# Altium project MainBoard.PrjPCB
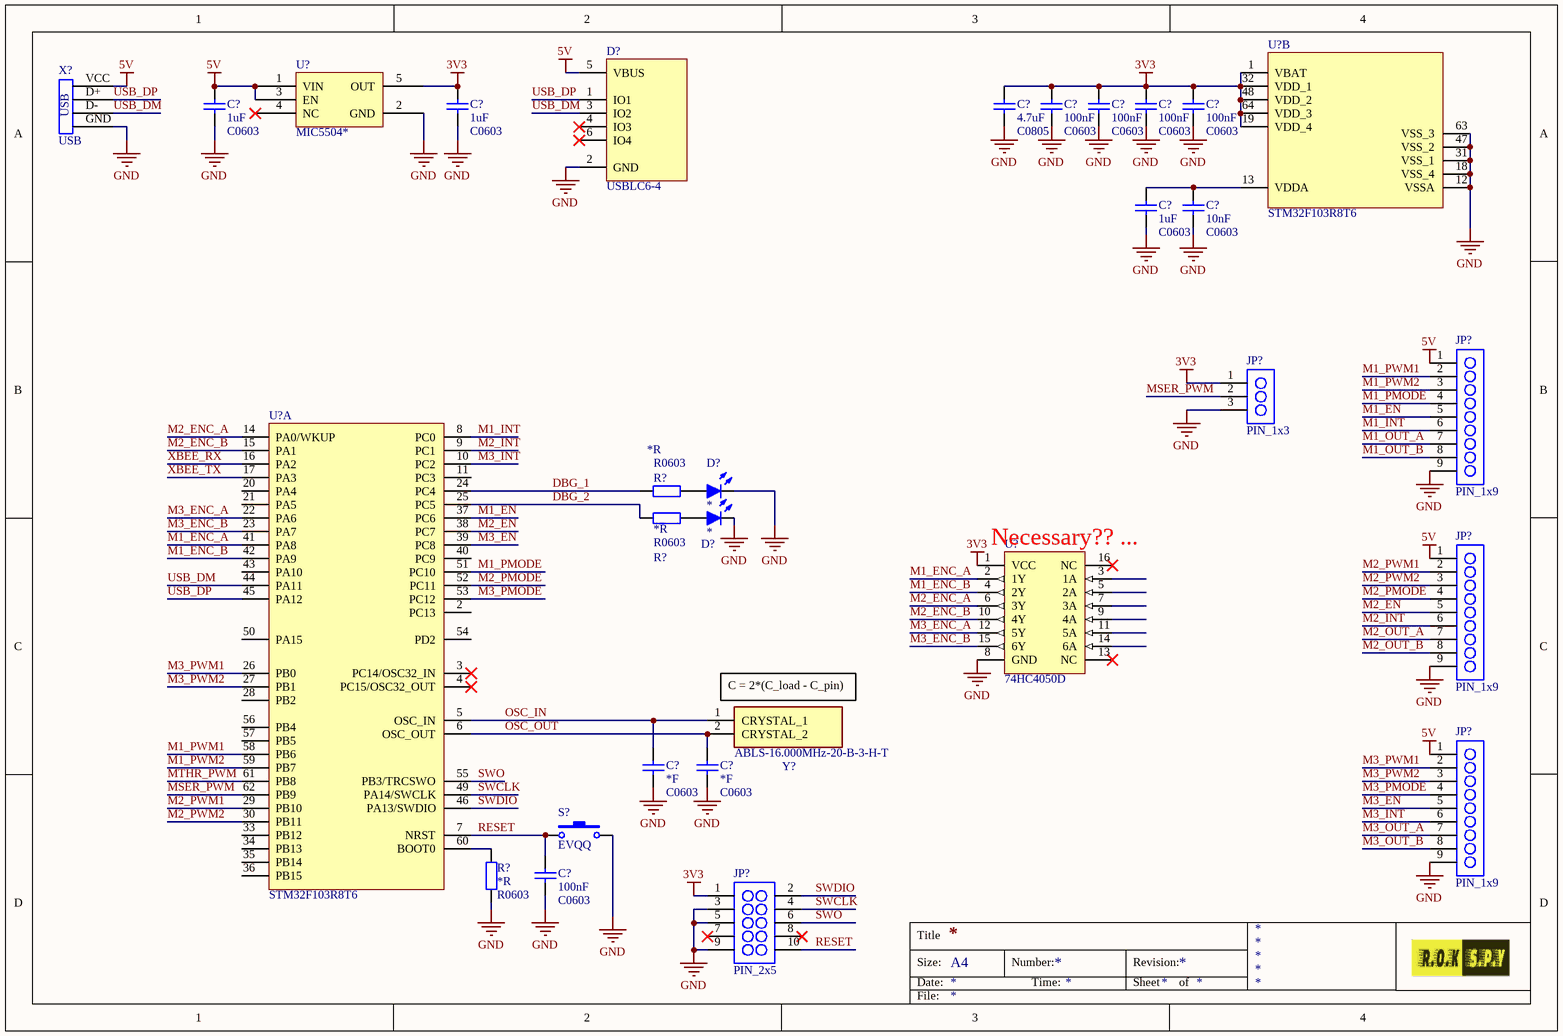
[diagram p0: MainBoard.SchDoc]
1 sheet, 30 parts. Net scope: global (net labels, ports and power ports of the same name join across sheets).
Board file: MainBoard.PcbDoc

## Sheet MainBoard.SchDoc
size A4

### Parts
(Parts that share a designator on the sheet are numbered #1, #2 ... from top to bottom, then left to right.)
C?#1  Capacitance: 1uF  [C0603]
C?#2  Capacitance: 1uF  [C0603]
C?#3  Capacitance: 4.7uF  [C0805]
C?#4  Capacitance: 100nF  [C0603]
C?#5  Capacitance: 100nF  [C0603]
C?#6  Capacitance: 100nF  [C0603]
C?#7  Capacitance: 100nF  [C0603]
C?#8  Capacitance: 1uF  [C0603]
C?#9  Capacitance: 10nF  [C0603]
C?#10  Capacitance: *F  [C0603]
C?#11  Capacitance: *F  [C0603]
C?#12  Capacitance: 100nF  [C0603]
D?#1  USBLC6-4  [SOT-236]
D?#2  LED  [LED_0603]  (value not drawn)
D?#3  LED  [LED_0603]  (value not drawn)
JP?#1  PIN_1x9  [2.54_1X9H]
JP?#2  PIN_1x3  [1.27_1X3R]
JP?#3  PIN_1x9  [2.54_1X9H]
JP?#4  PIN_1x9  [2.54_1X9H]
JP?#5  PIN_2x5  [2.54_2X5H]
R?#1  *R  [R0603]
R?#2  *R  [R0603]
R?#3  *R  [R0603]
S?  EVQQ  [EVQQ]
U?#1  MIC5504*  [SOT-235]
U?#2  STM32F103R8T6  [QFP50P1200X1200X160-64N]  (part B of 2)
U?#3  74HC4050D  [SOP127P600X175-16N]
U?#4  STM32F103R8T6  [QFP50P1200X1200X160-64N]  (part A of 2)
X?  USB  [USB MiniB SMD]
Y?  ABLS-16.000MHz-20-B-3-H-T  [ABLS16000MHz20B3HT]

### Nets
3V3: C?#2.2 C?#3.2 C?#4.2 C?#5.2 C?#6.2 C?#7.2 JP?#2.1 JP?#5.1 U?#1.5(OUT) U?#2.1(VBAT) U?#2.19(VDD_4) U?#2.32(VDD_1) U?#2.48(VDD_2) U?#2.64(VDD_3) U?#3.1(VCC)
5V: C?#1.2 D?#1.5(VBUS) JP?#1.1 JP?#3.1 JP?#4.1 U?#1.1(VIN) U?#1.3(EN) X?.VCC
GND: C?#1.1 C?#2.1 C?#3.1 C?#4.1 C?#5.1 C?#6.1 C?#7.1 C?#8.1 C?#9.1 C?#10.1 C?#11.1 C?#12.1 D?#1.2(GND) D?#2.2(K) D?#3.2(K) JP?#1.9 JP?#2.3 JP?#3.9 JP?#4.9 JP?#5.3 JP?#5.5 JP?#5.9 R?#3.1 S?.2 U?#1.2(GND) U?#2.12(VSSA) U?#2.18(VSS_4) U?#2.31(VSS_1) U?#2.47(VSS_2) U?#2.63(VSS_3) U?#3.8(GND) X?.GND
DBG_1: R?#1.2 U?#4.24(PC4)
DBG_2: R?#2.2 U?#4.25(PC5)
M1_EN: JP?#1.5 U?#4.37(PC6)
M1_ENC_A: U?#3.2(1Y) U?#4.41(PA8)
M1_ENC_B: U?#3.4(2Y) U?#4.42(PA9)
M1_INT: JP?#1.6 U?#4.8(PC0)
M1_OUT_A: JP?#1.7
M1_OUT_B: JP?#1.8
M1_PMODE: JP?#1.4 U?#4.51(PC10)
M1_PWM1: JP?#1.2 U?#4.58(PB6)
M1_PWM2: JP?#1.3 U?#4.59(PB7)
M2_EN: JP?#3.5 U?#4.38(PC7)
M2_ENC_A: U?#3.6(3Y) U?#4.14(PA0/WKUP)
M2_ENC_B: U?#3.10(4Y) U?#4.15(PA1)
M2_INT: JP?#3.6 U?#4.9(PC1)
M2_OUT_A: JP?#3.7
M2_OUT_B: JP?#3.8
M2_PMODE: JP?#3.4 U?#4.52(PC11)
M2_PWM1: JP?#3.2 U?#4.29(PB10)
M2_PWM2: JP?#3.3 U?#4.30(PB11)
M3_EN: JP?#4.5 U?#4.39(PC8)
M3_ENC_A: U?#3.12(5Y) U?#4.22(PA6)
M3_ENC_B: U?#3.15(6Y) U?#4.23(PA7)
M3_INT: JP?#4.6 U?#4.10(PC2)
M3_OUT_A: JP?#4.7
M3_OUT_B: JP?#4.8
M3_PMODE: JP?#4.4 U?#4.53(PC12)
M3_PWM1: JP?#4.2 U?#4.26(PB0)
M3_PWM2: JP?#4.3 U?#4.27(PB1)
MSER_PWM: JP?#2.2 U?#4.62(PB9)
MTHR_PWM: U?#4.61(PB8)
OSC_IN: C?#10.2 U?#4.5(OSC_IN) Y?.1(CRYSTAL_1)
OSC_OUT: C?#11.2 U?#4.6(OSC_OUT) Y?.2(CRYSTAL_2)
RESET: C?#12.2 JP?#5.10 S?.1 U?#4.7(NRST)
SWCLK: JP?#5.4 U?#4.49(PA14/SWCLK)
SWDIO: JP?#5.2 U?#4.46(PA13/SWDIO)
SWO: JP?#5.6 U?#4.55(PB3/TRCSWO)
USB_DM: D?#1.3(IO2) U?#4.44(PA11) X?.D-
USB_DP: D?#1.1(IO1) U?#4.45(PA12) X?.D+
XBEE_RX: U?#4.16(PA2)
XBEE_TX: U?#4.17(PA3)
NetC?#8_2: C?#8.2 C?#9.2 U?#2.13(VDDA)
NetD?#2_1: D?#2.1(A) R?#1.1
NetD?#3_1: D?#3.1(A) R?#2.1
NetR?#3_2: R?#3.2 U?#4.60(BOOT0)

Not connected (* = marked no-connect by the designer): D?#1 4(IO3)* 6(IO4)*; JP?#5 7* 8*; U?#1 4(NC)*; U?#3 3(1A) 5(2A) 7(3A) 9(4A) 11(5A) 13(NC)* 14(6A) 16(NC)*; U?#4 2(PC13) 3(PC14/OSC32_IN)* 4(PC15/OSC32_OUT)* 11(PC3) 20(PA4) 21(PA5) 28(PB2) 33(PB12) 34(PB13) 35(PB14) 36(PB15) 40(PC9) 43(PA10) 50(PA15) 54(PD2) 56(PB4) 57(PB5)

### Notes on the sheet
- (near U?#3) Necessary?? ...
- (near Y?) C = 2*(C_load - C_pin)
- Title
- Size:
- Date:
- A4
- Number:
- Time:
- Revision:
- Sheet
- of
- File:

### Library data of the parts
C?#1-C?#12 = Capacitor: Ceramic capacitor; Type: MLCC; Voltage rating: *V; ComponentLinknDescription: Datasheet; Characteristic: *; Manufacturer: *; ComponentLinknURL: *
  C?#1 C?#2 C?#4-C?#12: Note: C0603
  C?#3: Note: C0805
D?#1 = USBLC6-4: USB ESD Protection; Manufacturer: ST Microelectronics; ComponentLinknDescription: Datasheet; Space heritage: false; Verified: false; Part number: USBLC6-4
D?#2 D?#3 = LED: Light Emitting Diode; ComponentLinknDescription: Datasheet; Space heritage: false; Current rating: *mA; Power dissipation: false; Colour: *
R?#1-R?#3 = Resistor: Precision: *%; Voltage rating: *V; Temp coefficient: *ppm; Power rating: *mW; ComponentLinknDescription: Datasheet; Manufacturer: *; ComponentLinknURL: *; Resistance: *R; Note: R0603
S? = EVQQ: Switch; Manufacturer: Panasonic; ComponentLinknDescription: Datasheet; Space heritage: false; Drawn by: Erik Ilbis; Verified: false; Part number: EVQQ
U?#1 = MIC5504: Low-dropout voltage regulator; Manufacturer: Microchip/Micrel; Space heritage: false; Current Rating: 300 mA; Input Voltage: 2V5 to 5V5; Accuracy: 2%; Part number: MIC5504; Verified: false; Drawn by: Roberts Oskars Komarovskis; ComponentLink1Description: Datasheet; ComponentLink1URL: https://www.mouser.ee/datasheet/2/268/MIC550X-1082389.pdf; Package Type: *
U?#2 U?#4 = STM32F103R8T6: Medium-density performance line ARM®-based 32-bit MCU with 64 or 128 KB Flash, USB, CAN, 7 timers, 2 ADCs, 9 com. interfaces; PartNumber: STM32F103R8T6; Drawn By: Roberts Oskars Komarovskis; Farnell Order Nr: 3129750; ComponentLink1Description: Datasheet; ComponentLink1URL: https://4donline.ihs.com/images/VipMasterIC/IC/SGST/SGST-S-A0001117293/SGST-S-A0001117293-1.pdf?hkey=6D3A4C79FDBF58556ACFDE234799DDF0
U?#3 = 74HC4050D: Logic Level Converter, Maximum output voltage is equal to Vcc; Manufacturer: Nexperia; Supply Voltage: 2 - 6V; Max input voltage: 15V; ComponentLink1Description: Datasheet; ComponentLink1URL: http://www.farnell.com/datasheets/2030251.pdf?_ga=2.69434709.497144466.1600641848-1290644116.1596735146; Drawn By: Roberts Oskars Komarovskis; PartNumber: 74HC4050D; Farnell Order nr.: 1085272
Y? = ABLS-16.000MHz-20-B-3-H-T: Crystal or Oscillator; Manufacturer_Name: ABRACON; Datasheet Link: https://componentsearchengine.com/Datasheets/2/ABLS-16.000MHZ-20-B-3-H-T.pdf; Height: 4.2mm; Manufacturer_Part_Number: ABLS-16.000MHz-20-B-3-H-T; ComponentLink1Description: Datasheet; ComponentLink1URL: https://componentsearchengine.com/Datasheets/2/ABLS-16.000MHZ-20-B-3-H-T.pdf; Farnell Order Nr: 3228387
JP?#1 JP?#3 JP?#4 = PIN_1x9: Manufacturer: *; Part Number: *; ComponentLinknDescription: *; ComponentLinknURL: *; Drawn By: Erik Ilbis
JP?#2 = PIN_1x3: Manufacturer: *; Part Number: *; ComponentLinknDescription: *; ComponentLinknURL: *; Drawn By: Erik Ilbis
JP?#5 = PIN_2x5: Manufacturer: *; Part Number: *; ComponentLinknDescription: *; ComponentLinknURL: *; Drawn By: Erik Ilbis